# EAGLE schematic kugavd (EAGLE 7.6.0)
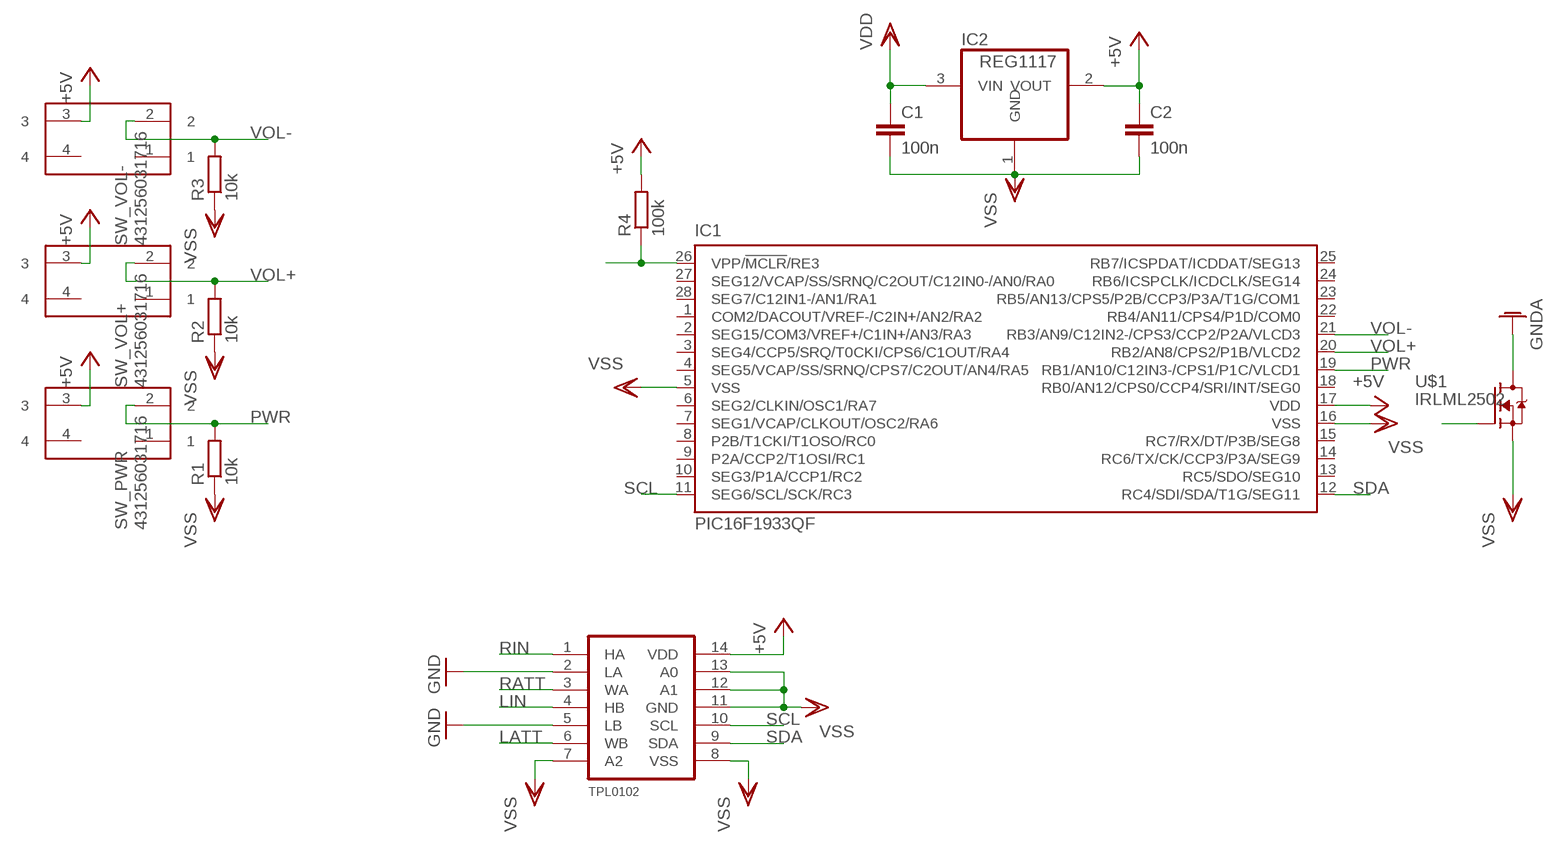
[diagram p0: schematic, sheet 1]

## Parts
C1  100n  C-EUC1206K  [C1206K]
C2  100n  C-EUC1206K  [C1206K]
IC1  PIC16F1933QF  [QFN28-ML_6X6MM]
IC2  REG1117  [SOT223]
R1  10k  R-EU_R1206  [R1206]
R2  10k  R-EU_R1206  [R1206]
R3  10k  R-EU_R1206  [R1206]
R4  100k  R-EU_R1206  [R1206]
SW_PWR  431256031716  [431256031716]
SW_VOL+  431256031716  [431256031716]
SW_VOL-  431256031716  [431256031716]
TPL0102  TPL0102  [TSSOP16L]
U$1  IRLML2502  [SOT23]

## Nets
+5V: C2.1 IC1.17(VDD) IC2.2(VOUT) R4.2 SW_PWR.3 SW_VOL+.3 SW_VOL-.3 TPL0102.14(VDD)
GND: TPL0102.2(LA) TPL0102.5(LB)
GNDA: U$1.3(D)
LATT: TPL0102.6(WB)
LIN: TPL0102.4(HB)
N$1: U$1.1(G)
PWR: IC1.19(RB1/AN10/C12IN3-/CPS1/P1C/VLCD1) R1.2 SW_PWR.2
RATT: TPL0102.3(WA)
RIN: TPL0102.1(HA)
SCL: IC1.11(SEG6/SCL/SCK/RC3) TPL0102.10(SCL)
SDA: IC1.12(RC4/SDI/SDA/T1G/SEG11) TPL0102.9(SDA)
VDD: C1.1 IC2.3(VIN)
VOL+: IC1.20(RB2/AN8/CPS2/P1B/VLCD2) R2.2 SW_VOL+.2
VOL-: IC1.21(RB3/AN9/C12IN2-/CPS3/CCP2/P2A/VLCD3) R3.2 SW_VOL-.2
VPP: IC1.26(VPP/!MCLR!/RE3) R4.1
VSS: C1.2 C2.2 IC1.5(VSS) IC1.16(VSS) IC2.1(GND) R1.1 R2.1 R3.1 TPL0102.7(A2) TPL0102.8(VSS) TPL0102.11(GND) TPL0102.12(A1) TPL0102.13(A0) U$1.2(S)
Unconnected: IC1.1(COM2/DACOUT/VREF-/C2IN+/AN2/RA2) IC1.2(SEG15/COM3/VREF+/C1IN+/AN3/RA3) IC1.3(SEG4/CCP5/SRQ/T0CKI/CPS6/C1OUT/RA4) IC1.4(SEG5/VCAP/SS/SRNQ/CPS7/C2OUT/AN4/RA5) IC1.6(SEG2/CLKIN/OSC1/RA7) IC1.7(SEG1/VCAP/CLKOUT/OSC2/RA6) IC1.8(P2B/T1CKI/T1OSO/RC0) IC1.9(P2A/CCP2/T1OSI/RC1) IC1.10(SEG3/P1A/CCP1/RC2) IC1.13(RC5/SDO/SEG10) IC1.14(RC6/TX/CK/CCP3/P3A/SEG9) IC1.15(RC7/RX/DT/P3B/SEG8) IC1.18(RB0/AN12/CPS0/CCP4/SRI/INT/SEG0) IC1.22(RB4/AN11/CPS4/P1D/COM0) IC1.23(RB5/AN13/CPS5/P2B/CCP3/P3A/T1G/COM1) IC1.24(RB6/ICSPCLK/ICDCLK/SEG14) IC1.25(RB7/ICSPDAT/ICDDAT/SEG13) IC1.27(SEG12/VCAP/SS/SRNQ/C2OUT/C12IN0-/AN0/RA0) IC1.28(SEG7/C12IN1-/AN1/RA1) SW_PWR.1 SW_PWR.4 SW_VOL+.1 SW_VOL+.4 SW_VOL-.1 SW_VOL-.4

## Library data of the parts
C1 C2 = rcl:C-EU: CAPACITOR, European symbol
IC1 = microchip:PIC16F19*: Flash-Based, 8-Bit CMOS Microcontrollers wtih LCD Driver and nanoWatt XLP Technology Auto generated by make-symbol-device-package-bsdl.ulp Rev. 33 Source: http://ww1.microchip.com/downloads/en/DeviceDoc/41364D.pdf; MPN: PIC16F1933-I/ML; OC_FARNELL: 1755812; OC_NEWARK: 08R1936
IC2 = burr-brown:REG1117: 800mA and 1A Low Dropout (LDO) Positive Regulator 1.8V, 2.5V, 2.85V, 3.3V, 5V, and Adj; MPN: REG1117; OC_FARNELL: 1097566; OC_NEWARK: 14P6981
R1-R4 = rcl:R-EU_: RESISTOR, European symbol
SW_PWR SW_VOL+ SW_VOL- = Switches_rev16a:431256031716: WS-TST, 6*6mm right angle Tact switch,THT, height 3.15mm, 4 pins, black actuator, 160gf
TPL0102 = tpl0102:TPL0102
U$1 = Kuga2_parts:IRLML2502